# EAGLE design S1 (EAGLE 9.0.0)
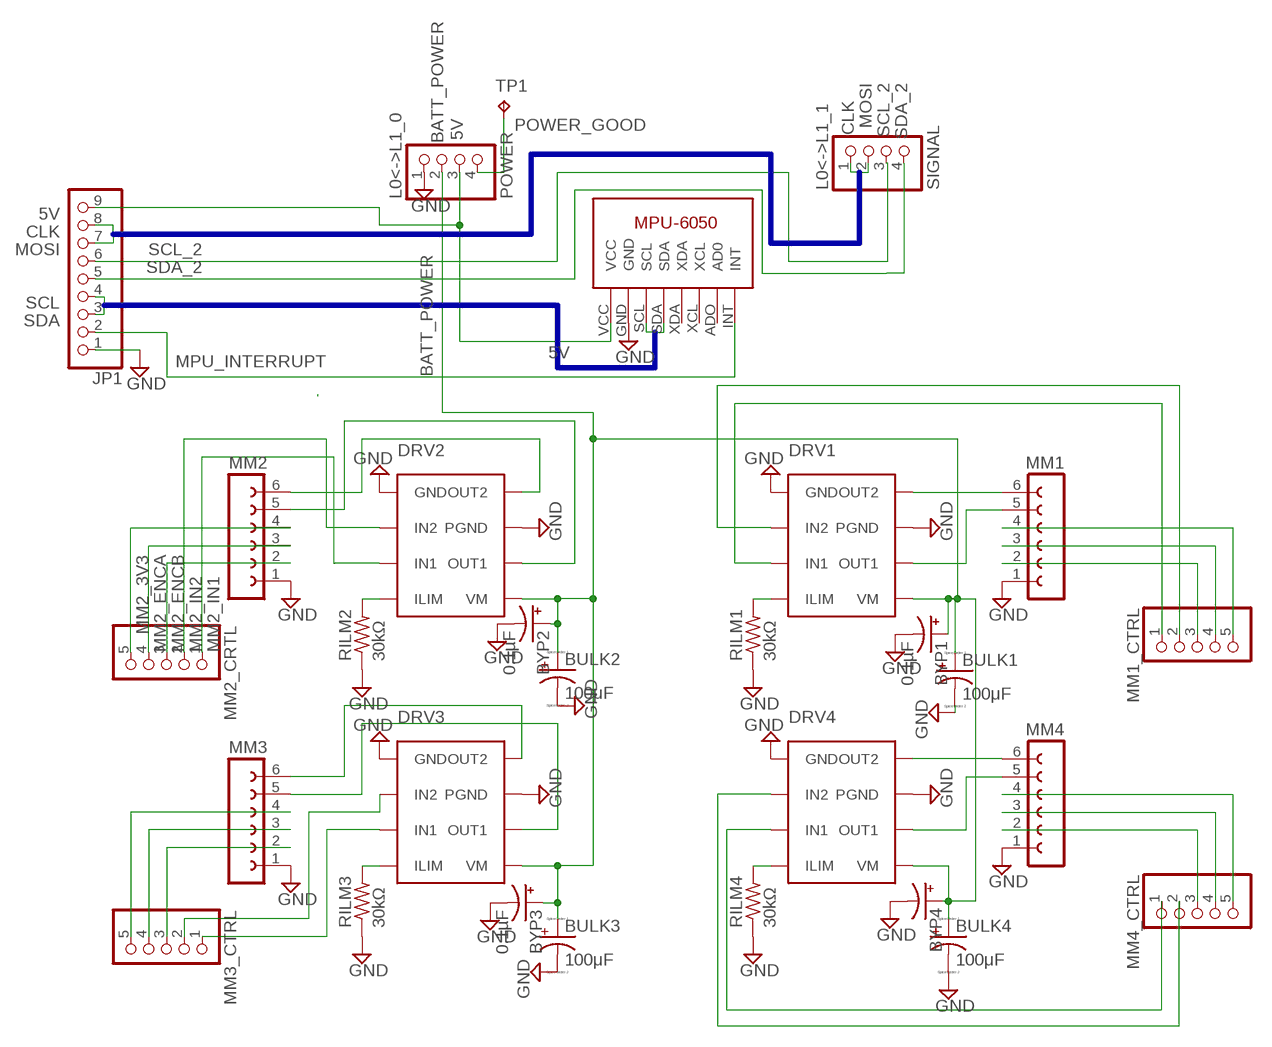
[diagram p0: schematic, sheet 1]

## Parts
BULK1  100μF  CPOL-US153CLV-0605  [153CLV-0605]
BULK2  100μF  CPOL-US153CLV-0605  [153CLV-0605]
BULK3  100μF  CPOL-US153CLV-0605  [153CLV-0605]
BULK4  100μF  CPOL-US153CLV-0605  [153CLV-0605]
BYP1  0.1µF  CPOL-USA/3216-18R  [A/3216-18R]
BYP2  0.1µF  CPOL-USA/3216-18R  [A/3216-18R]
BYP3  0.1µF  CPOL-USA/3216-18R  [A/3216-18R]
BYP4  CPOL-USA/3216-18R  [A/3216-18R]
DRV1  DRV8871  [SO-8_POWERPAD]
DRV2  DRV8871  [SO-8_POWERPAD]
DRV3  DRV8871  [SO-8_POWERPAD]
DRV4  DRV8871  [SO-8_POWERPAD]
JP1  PINHD-1X9  [1X09]
L0<->L1_0  POWER  PINHD-1X4/90  [1X04/90]
L0<->L1_1  SIGNAL  PINHD-1X4/90  [1X04/90]
MM1  FE06-1  [FE06]
MM1_CTRL  PINHD-1X5  [1X05]
MM2  FE06-1  [FE06]
MM2_CRTL  PINHD-1X5  [1X05]
MM3  FE06-1  [FE06]
MM3_CTRL  PINHD-1X5  [1X05]
MM4  FE06-1  [FE06]
MM4_CTRL  PINHD-1X5  [1X05]
RILM1  30kΩ  R-US_M1206  [M1206]
RILM2  30kΩ  R-US_M1206  [M1206]
RILM3  30kΩ  R-US_M1206  [M1206]
RILM4  30kΩ  R-US_M1206  [M1206]
TP1  TPTP18R  [TP18R]
U$1  GY-521_MPUP6050  [GY-521]

## Nets
5V: JP1.9 L0<->L1_0.3 U$1.VCC
BATT_POWER: BULK1.+ BULK2.+ BULK3.+ BULK4.+ BYP1.+ BYP2.+ BYP3.+ BYP4.+ DRV1.5(VM) DRV2.5(VM) DRV3.5(VM) DRV4.5(VM) L0<->L1_0.2
CLK: JP1.8 L0<->L1_1.1
GND: BULK1.- BULK2.- BULK3.- BULK4.- BYP1.- BYP2.- BYP3.- BYP4.- DRV1.1(GND) DRV1.7(PGND) DRV2.1(GND) DRV2.7(PGND) DRV3.1(GND) DRV3.7(PGND) DRV4.1(GND) DRV4.7(PGND) JP1.1 L0<->L1_0.1 MM1.1 MM2.1 MM3.1 MM4.1 RILM1.1 RILM2.1 RILM3.1 RILM4.1 U$1.GND
IN1: DRV4.3(IN1) MM4_CTRL.1
IN2: DRV4.2(IN2) MM4_CTRL.2
MM2_3V3: MM2.4 MM2_CRTL.5
MM2_ENCA: MM2.3 MM2_CRTL.4
MM2_ENCB: MM2.2 MM2_CRTL.3
MM2_IN1: DRV2.3(IN1) MM2_CRTL.1
MM2_IN2: DRV2.2(IN2) MM2_CRTL.2
MOSI: JP1.7 L0<->L1_1.2
MPU_INTERRUPT: JP1.2 U$1.INT
N$1: DRV3.4(ILIM) RILM3.2
N$2: DRV2.4(ILIM) RILM2.2
N$3: DRV1.4(ILIM) RILM1.2
N$4: DRV4.4(ILIM) RILM4.2
N$5: DRV4.8(OUT2) MM4.6
N$6: DRV3.6(OUT1) MM3.5
N$7: MM3.4 MM3_CTRL.5
N$8: MM3.3 MM3_CTRL.4
N$9: MM1.4 MM1_CTRL.5
N$10: MM4.2 MM4_CTRL.3
N$17: MM3.2 MM3_CTRL.3
N$18: MM4.4 MM4_CTRL.5
N$21: DRV2.8(OUT2) MM2.6
N$22: DRV2.6(OUT1) MM2.5
N$23: DRV3.8(OUT2) MM3.6
N$24: DRV4.6(OUT1) MM4.5
N$25: DRV1.6(OUT1) MM1.5
N$26: DRV1.8(OUT2) MM1.6
N$27: DRV3.2(IN2) MM3_CTRL.2
N$36: DRV3.3(IN1) MM3_CTRL.1
N$37: MM1.3 MM1_CTRL.4
N$38: MM1.2 MM1_CTRL.3
N$39: DRV1.2(IN2) MM1_CTRL.2
N$40: DRV1.3(IN1) MM1_CTRL.1
N$41: MM4.3 MM4_CTRL.4
POWER_GOOD: L0<->L1_0.4 TP1.TP
SCL: JP1.4 U$1.SCL
SCL_2: JP1.6 L0<->L1_1.3
SDA: JP1.3 U$1.SDA
SDA_2: JP1.5 L0<->L1_1.4
Unconnected: U$1.ADO(AD0) U$1.XCL U$1.XDA

## Buses
I2C:SCL,SDA
SPI:CLK,CS,MISO,MOSI

## Library data of the parts
BULK1-BULK4 = resistor:CPOL-US: POLARIZED CAPACITOR, American symbol
BYP1-BYP4 = rcl:CPOL-US: POLARIZED CAPACITOR, American symbol; SPICEPREFIX: C
DRV1-DRV4 = Parts:DRV8871
JP1 = pinhead:PINHD-1X9: PIN HEADER
L0<->L1_0 L0<->L1_1 = pinhead:PINHD-1X4: PIN HEADER
MM1-MM4 = con-lsta:FE06-1: FEMALE HEADER; OC_FARNELL: unknown; OC_NEWARK: unknown
MM1_CTRL MM2_CRTL MM3_CTRL MM4_CTRL = pinhead:PINHD-1X5: PIN HEADER
RILM1-RILM4 = resistor:R-US_: RESISTOR, American symbol
TP1 = testpad:TP: Test pad
U$1 = Parts:GY-521_MPUP6050: MPU6050

## Board
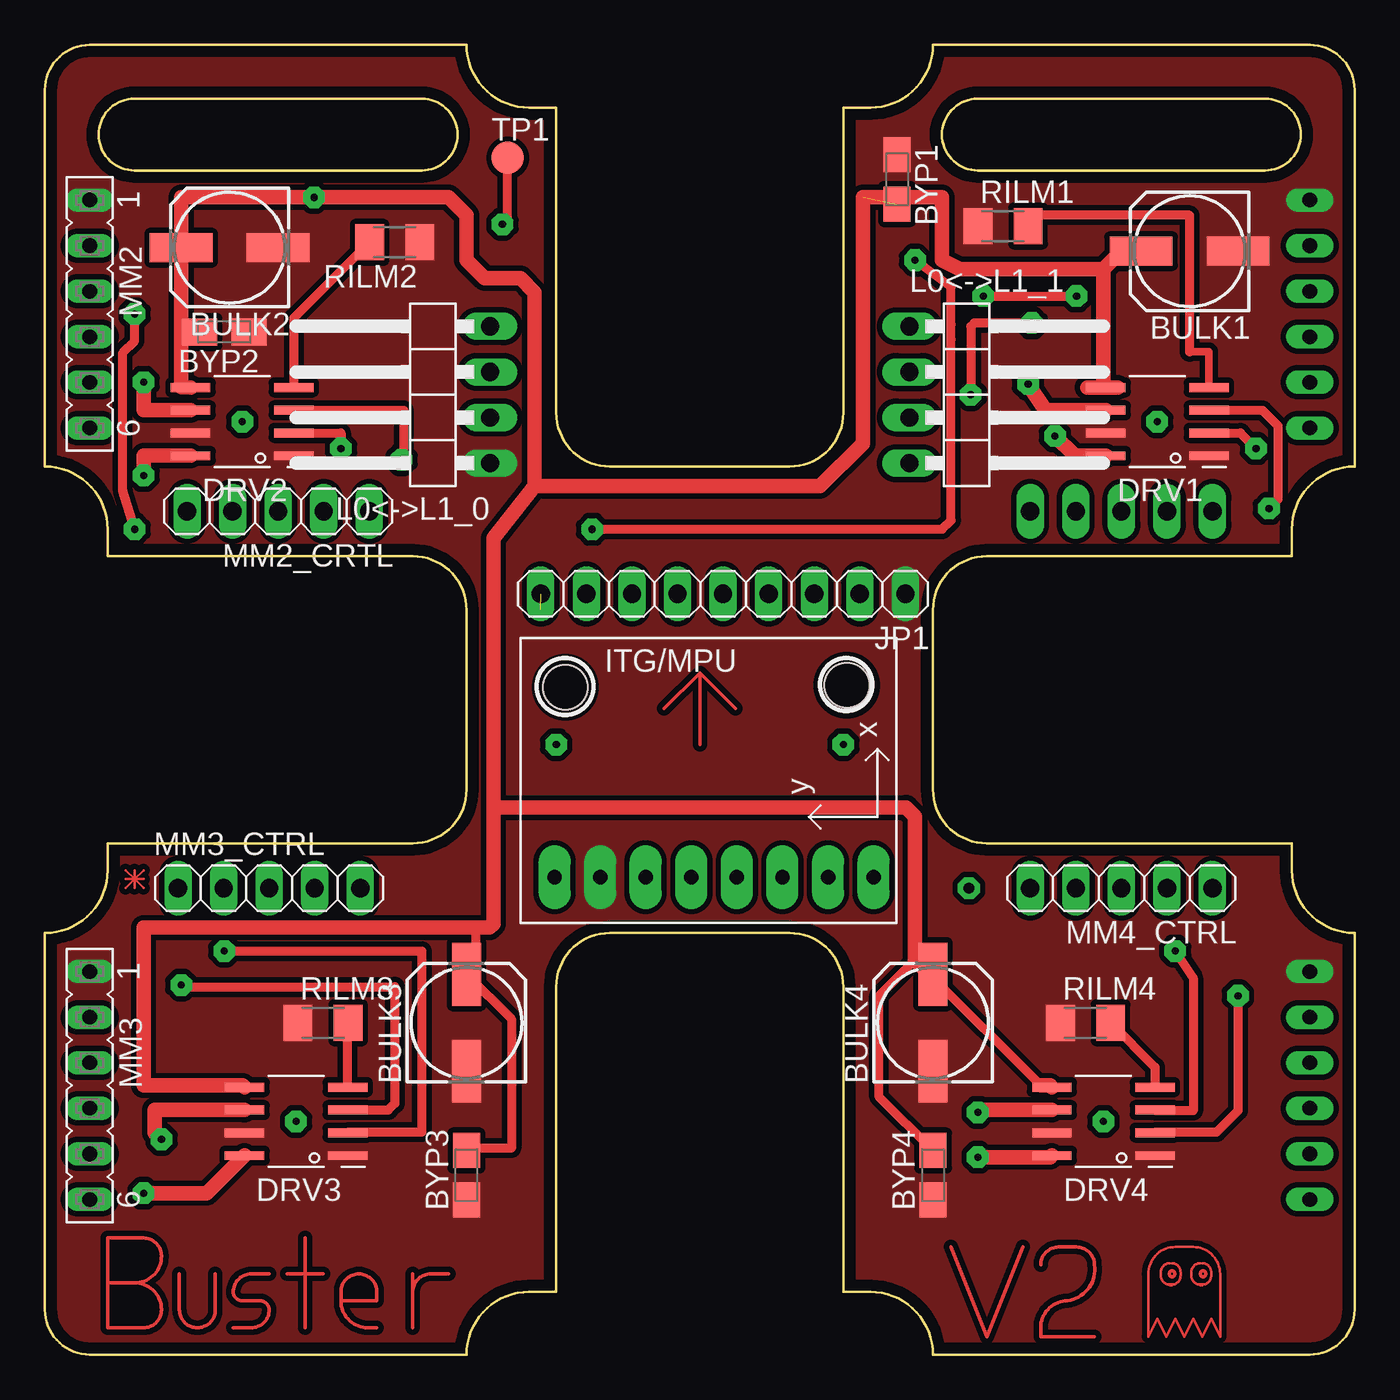
[diagram p1: board, top side]
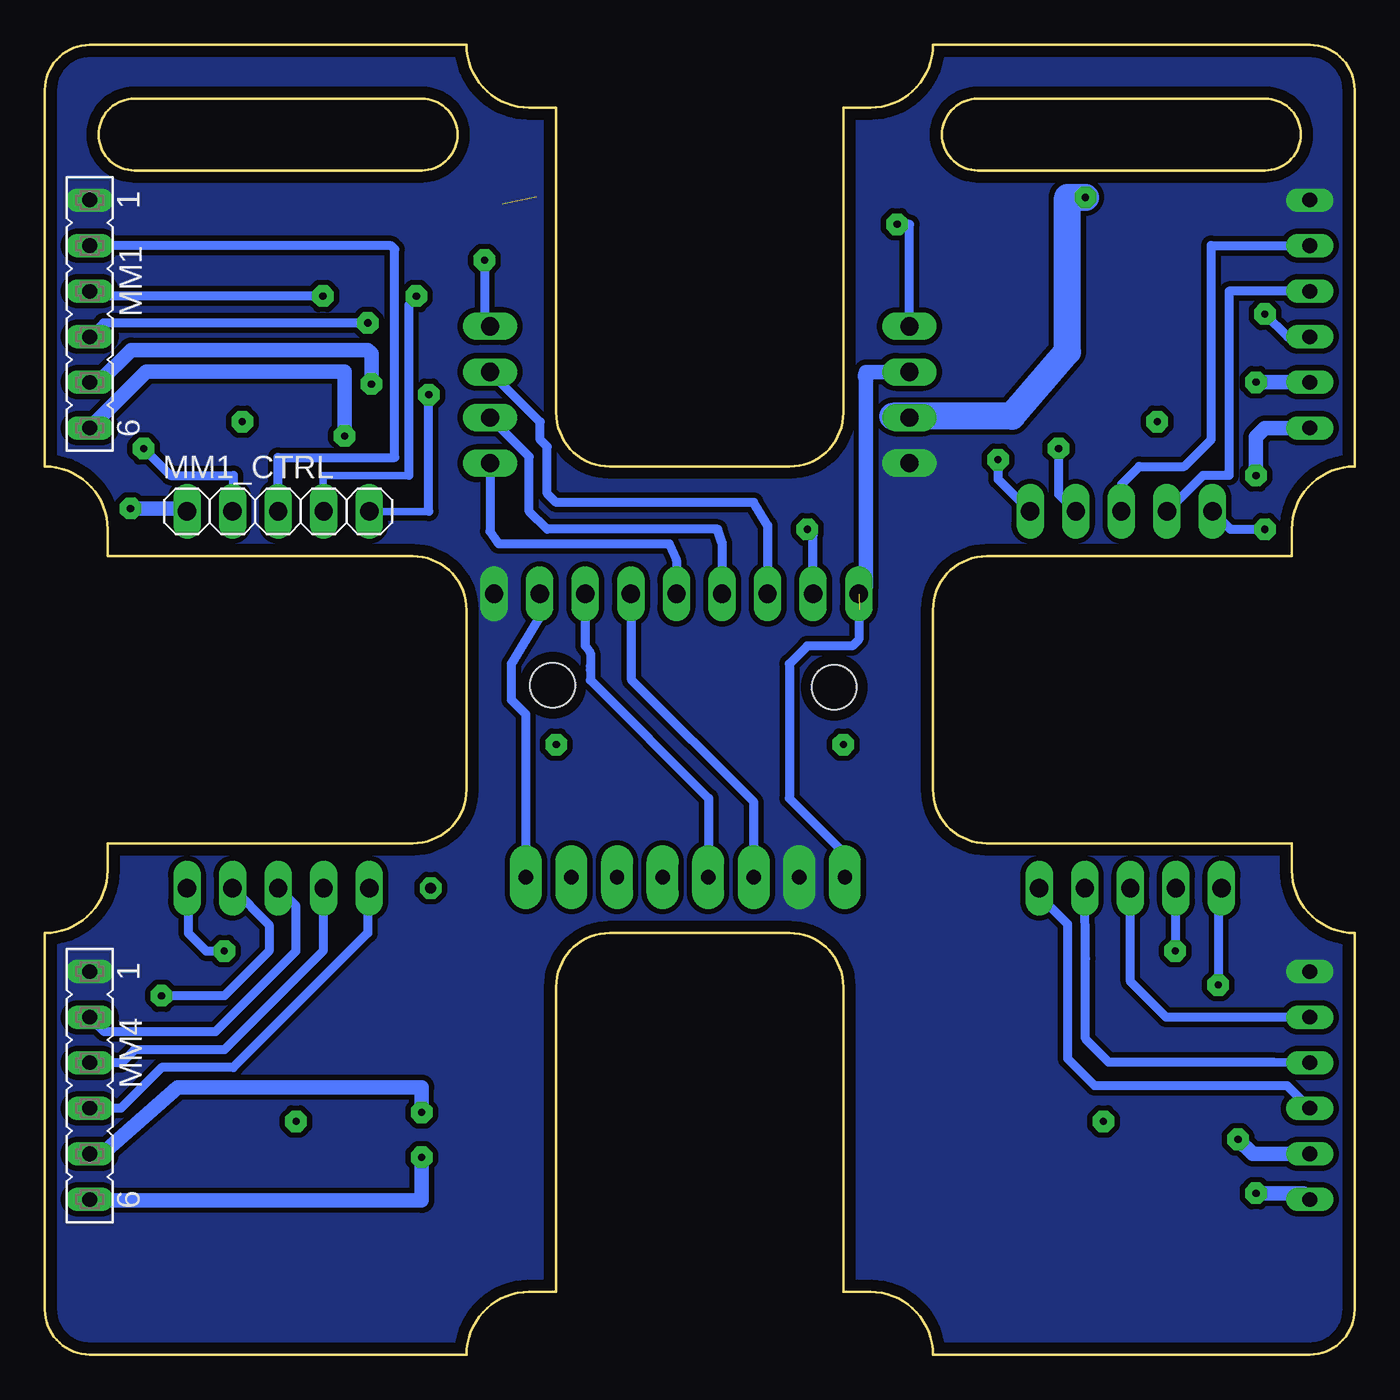
[diagram p2: board, bottom side, seen from below]

Size 73 x 73 mm. Coordinates in mm from the lower left corner, seen from the top.
Outline: 0,70.5 0,49.5 arc-90 3.5,46 3.5,44.5 20.5,44.5 arc-90 23.5,41.5 23.5,31.5 arc-90 20.5,28.5 3.5,28.5 3.5,27 arc-90 0,23.5 0,2.5 arc90 2.5,0 23.5,0 arc-90 27,3.5 28.5,3.5 28.5,20.5 arc-90 31.5,23.5 41.5,23.5 arc-90 44.5,20.5 44.5,3.5 46,3.5 arc-90 49.5,0 70.5,0 arc90 73,2.5 73,23.5 arc-90 69.5,27 69.5,28.5 52.5,28.5 arc-90 49.5,31.5 49.5,41.5 arc-90 52.5,44.5 69.5,44.5 69.5,46 arc-90 73,49.5 73,70.5 arc90 70.5,73 49.5,73 arc-90 46,69.5 44.5,69.5 44.5,52.5 arc-90 41.5,49.5 31.5,49.5 arc-90 28.5,52.5 28.5,69.5 27,69.5 arc-90 23.5,73 2.5,73 arc90 0,70.5
Outline: 5,70 21,70 arc-90 23,68 arc-90 21,66 5,66 arc-90 3,68 arc-90 5,70
Outline: 52,70 68,70 arc-90 70,68 arc-90 68,66 52,66 arc-90 50,68 arc-90 52,70
Copper layers (1*16): Top 0.035mm / dielectric 1.5mm / Bottom 0.035mm
Design rules "default *": minimum track width 6mil, minimum drill 0.35mm, track to track 6mil, track to pad 6mil, pad to pad 6mil, via to via 6mil, smd to smd 6mil, copper to edge 0.6mm, drill to drill 6mil, minimum pad ring 10mil, minimum via ring 8mil, stop-mask expansion 4mil, vias tented up to drill 0mil, thermal gap 10mil
Holes 2.5 mm at 44.7,37.3 29,37.2

### Footprints (pad centres in the part's own frame; a part is rotated, then mirrored left to right if it is on the bottom)
153CLV-0605 = smd 3.5 x 1.6: + 2.7,0; - -2.7,0
A/3216-18R = smd 1.95 x 1.5: + 1.375,0; - -1.375,0
SO-8_POWERPAD = smd 0.5 x 2.2: 1 -1.905,-2.875; 2 -0.635,-2.875; 3 0.635,-2.875; 4 1.905,-2.875; 5 1.905,2.875; 6 0.635,2.875; 7 -0.635,2.875; 8 -1.905,2.875
1X09 = drill 1.016 long: 1 -10.16,0; 2 -7.62,0; 3 -5.08,0; 4 -2.54,0; 5 0,0; 6 2.54,0; 7 5.08,0; 8 7.62,0; 9 10.16,0
1X04/90 = drill 1.016 long: 1 -3.81,-3.81; 2 -1.27,-3.81; 3 1.27,-3.81; 4 3.81,-3.81
FE06 = drill 0.813 long: 1 -6.35,0; 2 -3.81,0; 3 -1.27,0; 4 1.27,0; 5 3.81,0; 6 6.35,0
1X05 = drill 1.016 long: 1 -5.08,0; 2 -2.54,0; 3 0,0; 4 2.54,0; 5 5.08,0
M1206 = smd 1.6 x 2: 1 -1.4,0; 2 1.4,0
TP18R = smd 1.8 x 1.8: TP 0,0
GY-521 = drill 0.8 pad 1.778 long: ADO -5.49,-7.15; GND -5.49,5.55; INT -5.49,-9.69; SCL -5.49,3.01; SDA -5.49,0.47; VCC -5.49,8.09; XCL -5.49,-4.61; XDA -5.49,-2.07

### Placement (x,y rotation side)
BULK1  63.8,61.5 180 top
BULK2  10.3,61.7 180 top
BULK3  23.5,18.5 90 top
BULK4  49.5,18.5 90 top
BYP1  47.5,65.5 270 top
BYP2  10,57 180 top
BYP3  23.5,10 90 top
BYP4  49.5,10 90 top
DRV1  62,52 90 top
DRV2  11,52 90 top
DRV3  14,13 90 top
DRV4  59,13 90 top
JP1  37.8,42.4 180 top
L0<->L1_0  21,53.5 90 top
L0<->L1_1  52,53.5 270 top
MM1  70.5,58 270 bottom
MM1_CTRL  60,47 0 bottom
MM2  2.5,58 270 top
MM2_CRTL  13,47 180 top
MM3  2.5,15 270 top
MM3_CTRL  12.5,26 0 top
MM4  70.5,15 270 bottom
MM4_CTRL  60,26 180 top
RILM1  53.4,62.9 0 top
RILM2  19.5,62 180 top
RILM3  15.5,18.5 0 top
RILM4  58,18.5 0 top
TP1  25.8,66.7 0 top
U$1  36.5,32.1 90 top

### Tracks (layer width: path | path; a pad name or v marks a point on that pad's centre or on a via)
5V  (1 unrouted)
  Bottom 0.2: 27.61,41.54 27.67,41.5
  Bottom 0.508: JP1.9 27.64,39.86 28,39.5 30.5,39.5 31.5,38.5 31.5,31 28.5,28 28.5,26.7 U$1.VCC
  Bottom 0.8: L0<->L1_0.3 27.23,54.77 | 27.23,54.77 27.3,54.5 | 27.23,54.77 27.23,42.81 JP1.9
BATT_POWER  (via drill 0.4 pad 1.2)  (1 unrouted)
  Top 0.2: 7.6,56.5 8.62,56.5 BYP2.+ | 23.62,11.5 BYP3.+ | 24,21.7 23.9,21.6 | 49.25,21.25 49.25,20.25 49.5,20 BULK4.+ | 48.25,21.75 48.75,21.75
  Top 0.508: BULK3.+ 26,18.7 26,11.5 23.62,11.5 | 24,23.8 24,21.7 | 49.25,21.25 55.5,15 | BYP4.+ 46.5,14.38 46.5,20 48.25,21.75
  Top 0.8: 59.8,53.9 58.1,53.9 58.11,53.91 DRV1.5 59,54.03 59,60.5 60,61.5 BULK1.+ | 25,30.5 25,45.5 | 25,30.5 25,24 24.8,23.8 24,23.8 5.5,23.8 5.5,15 11.03,15 DRV3.5 | 25,30.5 48,30.5 48.5,30 48.5,22 48.75,21.75 49.25,21.25 | BULK3.+ 23.9,21.6 | 55.5,15 56.03,15 DRV4.5
  Top 0.813: DRV2.5 7.6,53.93 7.6,56.5 BULK2.+ 7.6,64.5 v15,64.5 22.5,64.5 23.5,63.5 23.5,61 24.5,60 26.5,60 27.3,59.2 27.3,48.4 | 27.3,48.4 30.58,48.4 30.67,48.42 43.21,48.42 45.58,50.79 45.58,64.5 50,64.5 50,61 51,60.5 59,60.5 | 25,45.5 27.3,48.4
  Bottom 0.813: 25.74,52.3 L0<->L1_0.2
  Bottom 1.5: v15,64.5 16,64.5 16,55.9 19.1,52.3 25.74,52.3
CLK  (via drill 0.4 pad 1.2)
  Top 0.508: v30.5,46 50,46 50.5,46.5 50.5,56.58 50.49,56.58 50.49,57.42 50.5,57.42 50.5,59.5 v48.5,61
  Bottom 0.508: JP1.8 30.18,45.68 v30.5,46 | v48.5,61 48.5,57.62 L0<->L1_1.1
GND
  cutout Top: 5,70 arc90 3,68 arc90 5,66 21,66 arc90 23,68 arc90 21,70
  pour Top (isolate 0.3, no thermals): 23.5,73 2.5,73 arc90 0,70.5 0,49.5 arc-90 3.5,46 3.5,44.5 20,44.5 20.5,44.5 arc-90 23.5,41.5 23.5,31.5 arc-90 20.5,28.5 3.5,28.5 3.5,27 arc-90 0,23.5 0,2.5 arc90 2.5,0 23.5,0 arc-90 27,3.5 28.5,3.5 28.5,20.5 arc-90 31.5,23.5 41.5,23.5 arc-90 44.5,20.5 44.5,3.5 46,3.5 arc-90 49.5,0 70.5,0 arc90 73,2.5 73,23.5 arc-90 69.5,27 69.5,28.5 52.5,28.5 arc-90 49.5,31.5 49.5,41.5 arc-90 52.5,44.5 69.5,44.5 69.5,46 arc-90 73,49.5 73,70.5 arc90 70.5,73 49.5,73 arc-90 46,69.5 44.5,69.5 44.5,52.5 arc-90 41.5,49.5 31.5,49.5 arc-90 28.5,52.5 28.5,69.5 27,69.5 arc-90
  cutout Top (no thermals): 52,70 arc90 50,68 arc90 52,66 68,66 arc90 70,68 arc90 68,70
  pour Bottom (isolate 0.3, no thermals): 23.5,73 2.5,73 arc90 0,70.5 0,49.5 arc-90 3.5,46 3.5,44.5 20.5,44.5 arc-90 23.5,41.5 23.5,31.5 arc-90 20.5,28.5 3.5,28.5 3.5,27 arc-90 0,23.5 0,2.5 arc90 2.5,0 23.5,0 arc-90 27,3.5 28.5,3.5 28.5,20.5 arc-90 31.5,23.5 41.5,23.5 arc-90 44.5,20.5 44.5,3.5 46,3.5 arc-90 49.5,0 70.5,0 arc90 73,2.5 73,23.5 arc-90 69.5,27 69.5,28.5 52.5,28.5 arc-90 49.5,31.5 49.5,41.5 arc-90 52.5,44.5 69.5,44.5 69.5,46 arc-90 73,49.5 73,70.5 arc90 70.5,73 49.5,73 arc-90 46,69.5 44.5,69.5 44.5,52.5 arc-90 41.5,49.5 31.5,49.5 arc-90 28.5,52.5 28.5,69.5 27,69.5 arc-90
  cutout Top (isolate 5, no thermals): 61.5,4.5 61.5,1 62,2 62.5,1 63,2 63.5,1 64,2 64.5,1 65,2 65.5,1 65.5,4.5 arc90 64,6 63,6 arc90
GND1
  cutout Bottom: 5,70 arc90 3,68 arc90 5,66 21,66 arc90 23,68 arc90 21,70
  cutout Bottom (no thermals): 52,70 arc90 50,68 arc90 52,66 68,66 arc90 70,68 arc90 68,70
IN1  (via drill 0.4 pad 1.2)
  Top 0.2: 61.91,13.6 DRV4.3
  Top 0.508: v63,22.5 64,21 64,13.6 61.91,13.6
  Bottom 0.508: MM4_CTRL.1 65,25.92 65,23.5 64,22.5 v63,22.5
IN2  (via drill 0.4 pad 1.2)
  Top 0.2: 62.01,12.5 DRV4.2
  Top 0.508: v66.5,20 66.5,13.6 65.3,12.4 61.91,12.4 DRV4.2
  Bottom 0.508: MM4_CTRL.2 60.5,23.96 60.5,22.5 63,20 v66.5,20
MM2_3V3  (via drill 0.4 pad 1.2)
  Top 0.508: v5,46 4.34,48.16 4.34,55.84 5,56.5 v5,58
  Bottom 0.508: 3,56.5 MM2.4 3.73,56.73 v5,58 | MM2_CRTL.5 6.92,46 v5,46
MM2_ENCA
  Bottom 0.508: MM2.3 7,59.27 7,49 8.46,49 MM2_CRTL.4
MM2_ENCB
  Bottom 0.508: MM2.2 8,61.81 8,51 9.5,49.5 12,49.5 13,48.5 MM2_CRTL.3
MM2_IN1  (via drill 0.4 pad 1.2)
  Top 0.2: 20,49.88 v19.88,49.88
  Top 0.508: DRV2.3 20,52.64 20,49.88
  Bottom 0.508: v19.88,49.88 19.88,48.8 MM2_CRTL.1
MM2_IN2  (via drill 0.4 pad 1.2)
  Top 0.508: DRV2.2 16.5,51.36 v16.5,50.5
  Bottom 0.508: MM2_CRTL.2 16.5,47.96 v16.5,50.5
MOSI
  Bottom 0.508: L0<->L1_1.2 45.4,51.98 45.4,51 45,50.6 45,48 44.5,47.5 33.5,47.5 32.72,46.22 JP1.7
MPU_INTERRUPT
  Bottom 0.508: U$1.INT 46.19,35.69 47,36.5 47,38.5 45.42,41.08 JP1.2
N$1
  Top 0.2: 16.88,18.48 RILM3.2
  Top 0.508: DRV3.4 16.88,18.48
N$2
  Top 0.508: RILM2.2 13.88,57.78 DRV2.4
N$3
  Top 0.2: 54.8,63.5 RILM1.2
  Top 0.42: DRV1.4 64.88,55.9 63.8,55.9
  Top 0.508: 63.8,55.9 63.8,63.5 54.8,63.5
N$4
  Top 0.508: RILM4.2 61.88,16.02 DRV4.4
N$5  (via drill 0.4 pad 1.2)
  Top 0.8: DRV4.8 56.03,11 v52,11
  Bottom 0.8: MM4.6 70.45,8.6 52,8.6 v52,11
N$6  (via drill 0.4 pad 1.2)
  Top 0.8: DRV3.6 6.13,13.64
  Top 0.813: 6.13,13.64 6.13,12.36 v6.5,12
  Bottom 0.8: 3.69,11.19 MM3.5
  Bottom 0.813: MM3.5 5.69,11.19 v6.5,12
N$7
  Bottom 0.42: 17.58,25.58 MM3_CTRL.5
  Bottom 0.508: 17.58,25.58 16,24 16,16.5 14.5,15 3.77,15 MM3.4
N$8
  Bottom 0.508: MM3.3 4.53,16.3 11,16.3 11.2,16.3 13.7,16.3 15,17.6 15,22.06 MM3_CTRL.4
N$9  (via drill 0.4 pad 1.2)
  Top 0.508: v55,57.5 51.8,57.5 51.6,57.3 v51.6,53.5
  Bottom 0.2: MM1_CTRL.5 54.76,47.2
  Bottom 0.42: MM1_CTRL.5 51.6,47
  Bottom 0.508: 51.6,47 v51.6,53.5 | v55,57.5 69.73,57.5 MM1.4
N$10
  Bottom 0.508: MM4.2 69.69,18 63.5,18 59,22.5 59,25 MM4_CTRL.3
N$11  (via drill 0.4 pad 1.2)
  other vias: 14,13
N$12
  Top 0.2: 3.5,4 3.5,6.5 5.5,6.5 arc-90 6.5,5.5 arc-90 5,4 | 3.5,4 3.5,1.5 5.5,1.5 arc90 6.5,2.5 arc90 5,4 | 5,4 3.5,4 | 3.5,4 5,4
N$13
  Top 0.2: 7.5,4.5 7.5,2.5 arc90 8.5,1.5 arc90 9.5,2.5 9.5,4.5
N$14
  Top 0.2: 12.5,4.5 11.5,4.5 arc90 10.5,3.5 arc90 11,3 11.5,3 12,3 arc-90 12.5,2.5 arc-90 11.5,1.5 10.5,1.5
N$15
  Top 0.2: 14.5,6.5 14.5,4.5 | 14.5,4.5 14.5,1.5 | 13.5,4.5 14.5,4.5 | 15.5,4.5 14.5,4.5
N$17
  Bottom 0.508: MM3.2 10.5,18.8 12.5,20.8 MM3_CTRL.3
N$18
  Bottom 0.508: MM4.4 68.77,13.73 66.5,16 62.5,16 55,23.5 55,25.92 MM4_CTRL.5
N$21  (via drill 0.4 pad 1.2)
  Top 0.813: DRV2.8 5.5,50.09 v5.5,49
  Bottom 0.813: MM2.6 5,51.65 5.5,51.15 v5.5,49
N$22  (via drill 0.4 pad 1.2)
  Top 0.813: DRV2.6 5.5,52.64 v5.5,54.2
  Bottom 0.813: v5.5,54.2 MM2.5
N$23  (via drill 0.4 pad 1.2)
  Top 0.8: DRV3.8 9.03,9 v5.5,9
  Bottom 0.8: v5.5,9 2.85,9 MM3.6
N$24  (via drill 0.4 pad 1.2)
  Top 0.8: DRV4.6 52,13.64 v52,13.5
  Bottom 0.8: v52,13.5 52,14.9 65.6,14.9 69.81,11.19 MM4.5
N$25  (via drill 0.4 pad 1.2)
  Top 0.8: v54.8,54.1 55.77,52.64 DRV1.6
  Bottom 0.8: MM1.5 70.01,54.19 68.2,56 55,56 54.8,55.8 v54.8,54.1
N$26  (via drill 0.4 pad 1.2)
  Top 0.8: v56.3,51.2 57.41,50.09 DRV1.8
  Bottom 0.8: v56.3,51.2 56.3,54.8 67.35,54.8 MM1.6
N$27  (via drill 0.4 pad 1.2)
  Top 0.2: 16.91,12.4 DRV3.2
  Top 0.508: v10,22.5 21,22.5 21,12.4 16.91,12.4
  Bottom 0.508: MM3_CTRL.2 10,25.96 v10,22.5
N$28  (via drill 0.4 pad 1.2)
  other vias: 11,52
N$31  (via drill 0.4 pad 1.2)
  other vias: 62,52
N$36  (via drill 0.4 pad 1.2)
  Top 0.2: v7.6,20.6 7.7,20.5
  Top 0.508: DRV3.3 19.14,13.64 19.5,14 19.5,20.5 7.7,20.5
  Bottom 0.508: MM3_CTRL.1 7.6,25.82 v7.6,20.6
N$37  (via drill 0.4 pad 1.2)
  Top 0.508: v52.3,59 v57.5,59
  Bottom 0.2: MM1_CTRL.4 57.5,47.04
  Bottom 0.42: 57.5,47.04 57.5,49 52.7,49 | 52.7,58.5 v52.3,59
  Bottom 0.508: 52.7,49 52.7,58.5 | v57.5,59 70.23,59 MM1.3
N$38
  Bottom 0.508: MM1_CTRL.3 60,50 53.5,50 53.5,61.6 53.7,61.8 MM1.2
N$39  (via drill 0.4 pad 1.2)
  Top 0.508: DRV1.2 66.64,51.36 v67.5,50.5
  Bottom 0.42: 62.5,47.04 MM1_CTRL.2
  Bottom 0.508: v67.5,50.5 66,49 62.5,49 62.5,47.04
N$40  (via drill 0.4 pad 1.2)
  Top 0.508: DRV1.3 67.86,52.64 68.73,51.77 68.73,47.66 v68.23,47.16
  Bottom 0.813: MM1_CTRL.1 65.24,47.16 v68.23,47.16
N$41
  Bottom 0.508: MM4_CTRL.4 57.5,25.96 57.5,22.5 63,17 68,17 68.73,16.27 MM4.3
N$42
  Top 0.2: 16.5,3 18.5,3 18.5,3.5 arc90 17.5,4.5 arc90 16.5,3.5 16.5,3 | 16.5,3 arc90 18,1.5 18.5,1.5
N$43
  Top 0.2: 20.5,4.5 20.5,3.5 | 20.5,3.5 20.5,1.5 | 20.5,3.5 arc-90 21.5,4.5 22.5,4.5
N$44
  Top 0.2: 36.5,38 34.5,36 | 36.5,38 38.5,36 | 36.5,38 36.5,34
N$45
  Top 0.127: 4.5,27 5,26.5 | 5,26.5 5.5,26 | 5,26.5 5.5,27 | 5,26.5 4.5,26
N$46
  Top 0.127: 5,27 5,26
N$47
  Top 0.127: 4.5,26.5 5.5,26.5
N$48  (via drill 0.4 pad 1.2)
  other vias: 28.5,34
N$49  (via drill 0.4 pad 1.2)
  other vias: 44.5,34
N$50  (via drill 0.4 pad 1.2)
  other vias: 59,13
N$51
  Top 0.2: 50.5,6 52.5,1 54.5,6
N$52
  Top 0.2: 55.5,5 arc-90 56.5,6 57.5,6 arc-90 58.5,5 arc-90 57,3 arc90 55.5,1.5 55.5,1 58,1 58.5,1
N$53
  Top 0.127: 61.5,4.5 61.5,1 62,2 62.5,1 63,2 63.5,1 64,2 64.5,1 65,2 65.5,1 65.5,4.5 arc90 64,6 63,6 arc90 61.5,4.5
N$54
  Top 0.127: 62.7,5.1 arc90 62.2,4.6 62.2,4.4 arc90 62.7,3.9 | 62.8,3.9 arc90 63.3,4.4 63.3,4.6 arc90 62.8,5.1
  Top 0.2: 62.7,3.9 62.8,3.9
N$55
  Top 0.127: 64.4,5.1 arc90 63.9,4.6 63.9,4.4 arc90 64.4,3.9 | 64.5,3.9 arc90 65,4.4 65,4.6 arc90 64.5,5.1
  Top 0.2: 64.4,3.9 64.5,3.9
N$56  (via drill 0.6 pad 1.2)
  other vias: 51.5,26
POWER_GOOD  (via drill 0.4 pad 1.2)
  Top 0.508: v25.5,63 25.8,63 TP1.TP
  Bottom 0.508: L0<->L1_0.4 24.81,63 v25.5,63
SCL
  Bottom 0.508: U$1.SCL 33.49,30.79 40.3,37.6 40.3,42.36 JP1.4
SCL_2
  Bottom 0.508: L0<->L1_1.3 46,50.04 46,47 45,46 35.5,46 35.26,45.26 JP1.6
SDA
  Bottom 0.508: JP1.3 42.88,39.52 42.6,39.1 42.6,38.38 42.6,38.17 42.6,37.6 36,31 36,26.64 U$1.SDA
SDA_2
  Bottom 0.508: L0<->L1_1.4 48.19,45.89 47.7,45.2 38.2,45.2 37.8,44.3 JP1.5
(copper drawn outside any net)
  shapes: Top circle x2